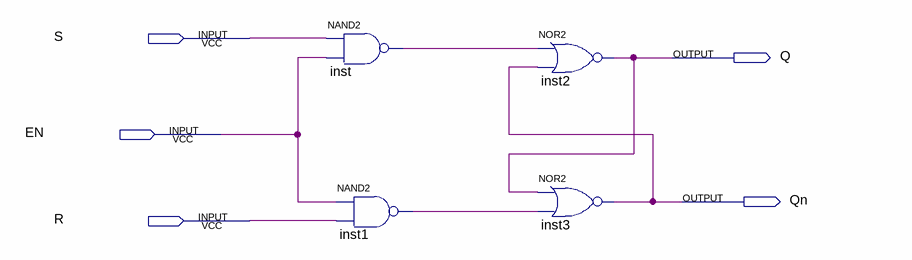
[diagram p0: schematic sheet]
// Quartus schematic LATCH_SR_EN.bdf as structural Verilog: 4 symbols, 5 pins
module LATCH_SR_EN (
  input  S,
  input  EN,
  input  R,
  output Q,
  output Qn
);

  wire inst1_out, inst_out;

  nand inst (inst_out, S, EN);
  nand inst1 (inst1_out, EN, R);
  nor inst2 (Q, inst_out, Qn);
  nor inst3 (Qn, Q, inst1_out);
endmodule
